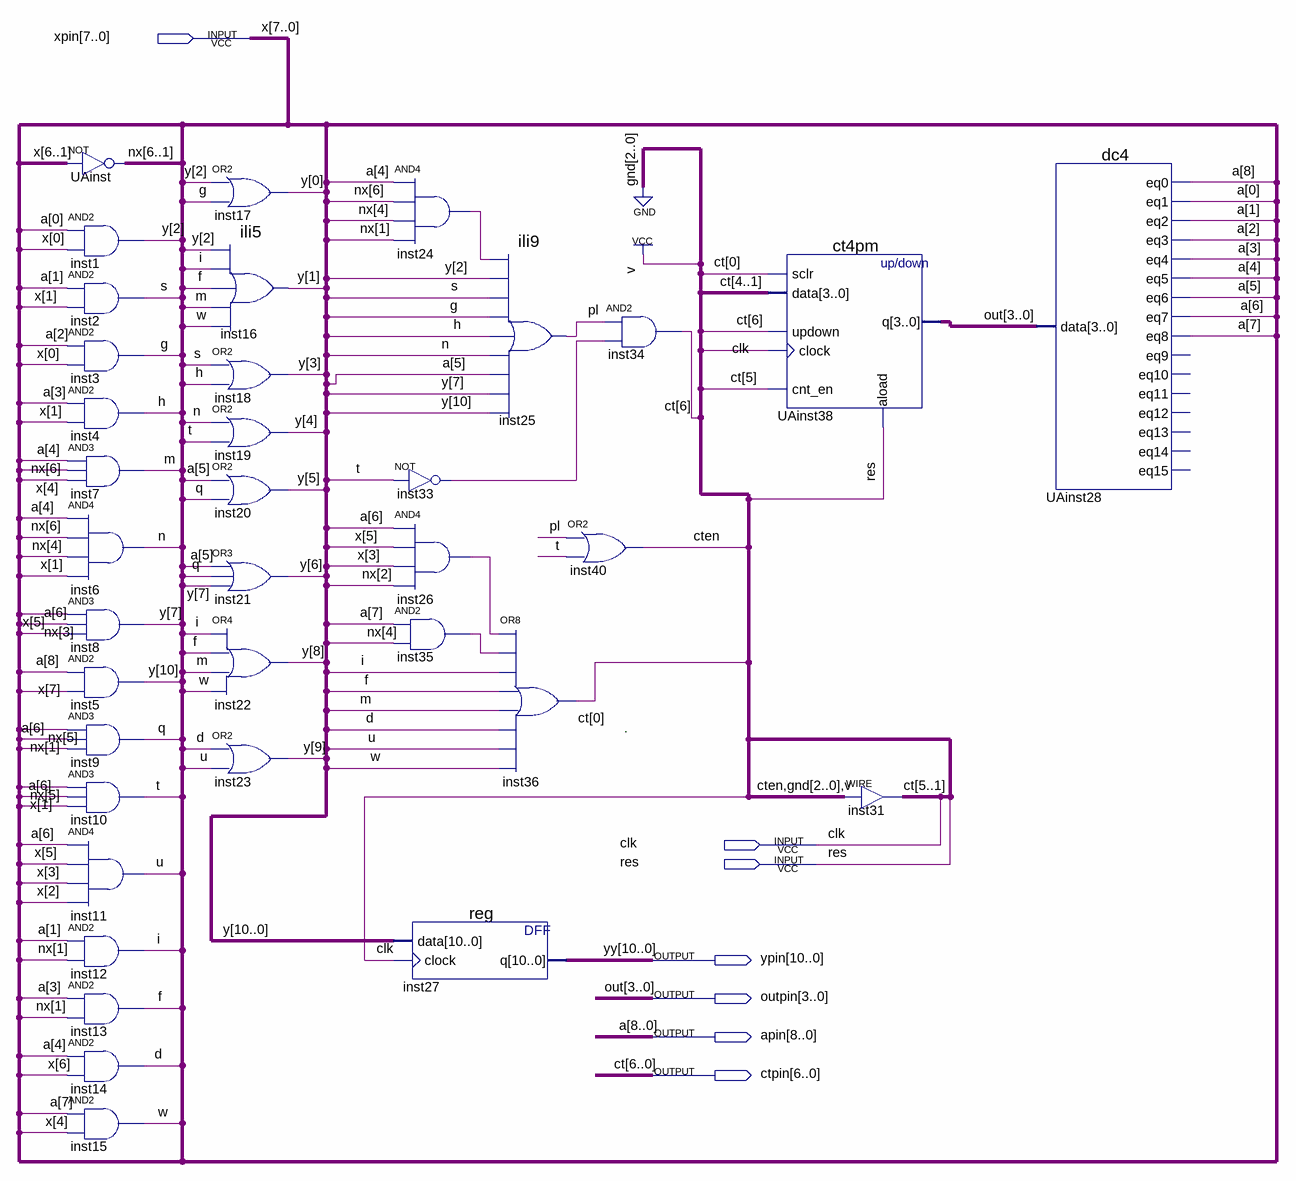
[diagram p0: schematic sheet]
// Quartus schematic test2.bdf as structural Verilog: 36 symbols, 7 pins
module test2 (
  input  [7:0] xpin,
  input  clk,
  input  res,
  output [10:0] ypin,
  output [3:0] outpin,
  output [8:0] apin,
  output [6:0] ctpin
);

  wire cten, d, f, g, h, i, inst24_out, inst26_out, inst33_out, inst35_out, m, n, pl, q, s, t, u, w;
  wire [6:1] nx;
  wire [10:0] y;

  assign nx = ~xpin[6:1];  // NOT UAinst, 6 bits wide
  and inst1 (y[2], apin[0], xpin[0]);
  and inst2 (s, apin[1], xpin[1]);
  and inst3 (g, apin[2], xpin[0]);
  and inst4 (h, apin[3], xpin[1]);
  and inst7 (m, apin[4], nx[6], xpin[4]);
  and inst6 (n, apin[4], nx[6], nx[4], xpin[1]);
  and inst8 (y[7], apin[6], xpin[5], nx[3]);
  and inst5 (y[10], apin[8], xpin[7]);
  and inst9 (q, apin[6], nx[5], nx[1]);
  and inst10 (t, apin[6], nx[5], xpin[1]);
  and inst11 (u, apin[6], xpin[5], xpin[3], xpin[2]);
  and inst12 (i, apin[1], nx[1]);
  and inst13 (f, apin[3], nx[1]);
  and inst14 (d, apin[4], xpin[6]);
  and inst15 (w, apin[7], xpin[4]);
  or inst17 (y[0], y[2], g);
  ili5 inst16 (.data0(y[2]), .data1(i), .data2(f), .data3(m), .data4(w), .result(y[1]));
  or inst18 (y[3], s, h);
  or inst19 (y[4], n, t);
  or inst20 (y[5], apin[5], q);
  or inst21 (y[6], apin[5], q, y[7]);
  or inst22 (y[8], i, f, m, w);
  or inst23 (y[9], d, u);
  and inst24 (inst24_out, apin[4], nx[6], nx[4], nx[1]);
  not inst33 (inst33_out, t);
  and inst26 (inst26_out, apin[6], xpin[5], xpin[3], nx[2]);
  and inst35 (inst35_out, apin[7], nx[4]);
  \reg  inst27 (.data(y), .clock(clk), .q(ypin));
  ili9 inst25 (
    .data0(inst24_out), .data1(y[2]), .data2(s), .data3(g), .data4(h), .data5(n), .data6(apin[5]),
    .data7(y[7]), .data8(y[10]), .result(pl));
  or inst36 (ctpin[0], inst26_out, inst35_out, i, f, m, d, u, w);
  or inst40 (cten, pl, t);
  and inst34 (ctpin[6], pl, inst33_out);
  ct4pm UAinst38 (
    .sclr(ctpin[0]), .data(ctpin[4:1]), .updown(ctpin[6]), .clock(clk), .cnt_en(ctpin[5]), .aload(res),
    .q(outpin));
  assign ctpin[5:1] = {cten, 4'b0001};  // WIRE inst31
  dc4 UAinst28 (
    .data(outpin), .eq0(apin[8]), .eq1(apin[0]), .eq2(apin[1]), .eq3(apin[2]), .eq4(apin[3]), .eq5(apin[4]),
    .eq6(apin[5]), .eq7(apin[6]), .eq8(apin[7]));  // open: eq9, eq10, eq11, eq12, eq13, eq14, eq15

  // Other names for the same wires on the sheet: a[8:0] = apin; ct[6:0] = ctpin; out[3:0] = outpin; x[7:0] = xpin;
  //   yy[10:0] = ypin

  // Notes on the sheet:
  //   .
endmodule
